# Altium schematic sheet STM32.SchDoc
size A; SheetNumber: 8; SheetTotal: 8
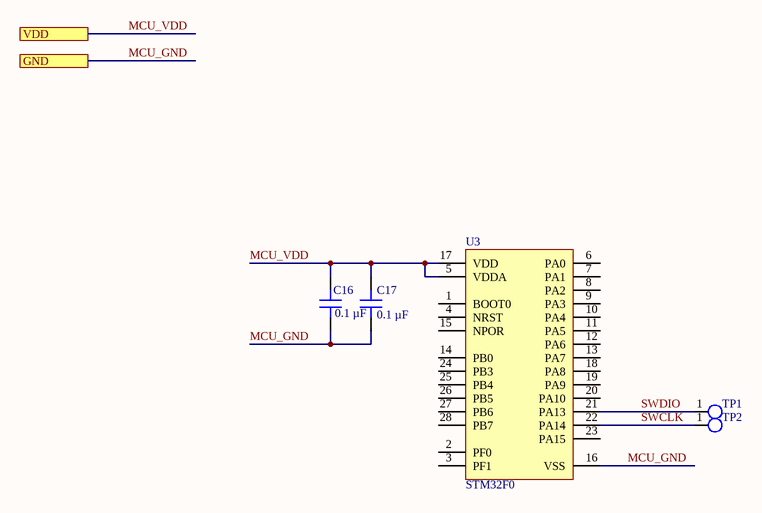
[diagram p0: STM32.SchDoc]

## Parts
C16  0.1 µF  [CAP 0402_1005]
C17  0.1 µF  [CAP 0402_1005]
TP1  0.635mm  [TP  0.635mm]  (value not drawn)
TP2  0.635mm  [TP  0.635mm]  (value not drawn)
U3  STM32F0  [QFN50P400X400X60-28N]

## Ports
GND, VDD

## Nets
MCU_GND: C16.1 C17.1 U3.16(VSS) ; port GND
MCU_VDD: C16.2 C17.2 U3.5(VDDA) U3.17(VDD) ; port VDD
SWCLK: TP2.1(TP) U3.22(PA14)
SWDIO: TP1.1(TP) U3.21(PA13)

Not connected (* = marked no-connect by the designer): U3 1(BOOT0) 2(PF0) 3(PF1) 4(NRST) 6(PA0) 7(PA1) 8(PA2) 9(PA3) 10(PA4) 11(PA5) 12(PA6) 13(PA7) 14(PB0) 15(NPOR) 18(PA8) 19(PA9) 20(PA10) 23(PA15) 24(PB3) 25(PB4) 26(PB5) 27(PB6) 28(PB7)

## Library data of the parts
C16 C17 = C0402C104K4RACAUTO: CAP CER 0.1UF 16V X7R 0402; manufacturer: KEMET; Tolerance: ±10%; Part Number: C0402C104K4RACAUTO; Value: 0.1 µF; Applications: Automotive, Bypass, Decoupling; Capacitance: 0.1 µF; componentlink1description: Datasheet; componentlink1url: https://api.kemet.com/component-edge/download/specsheet/C0402C104K4RACAUTO.pdf; componentlink2description: DigiKey Link; componentlink2url: https://www.digikey.com/en/products/detail/kemet/C0402C104K4RACAUTO/3314827; Device Package: 0402 (1005 Metric); lastupdated: 8/14/2022 9:05:51 PM; Lifecycle Status: Active; Minimum Order: 1; Mounting Type: Surface Mount, MLCC; Operating Temperature: -55°C ~ 125°C; Package / Case: 0402 (1005 Metric); packaging: TapeAndReel; partid: 3024; Part Status: Active; price: 0.01; Ratings: AEC-Q200; series: SMD Auto X7R; Size / Dimension: 0.039" L x 0.020" W (1.00mm x 0.50mm); Supplier 1: DigiKey; Supplier Part Number 1: 399-6828-1-ND; Temperature Coefficient: X7R; Thickness (Max): 0.022" (0.55mm); Voltage - Rated: 16V
TP1 TP2 = TP 0.635mm: Test point
U3 = STM32F0: 6-DOF IMU